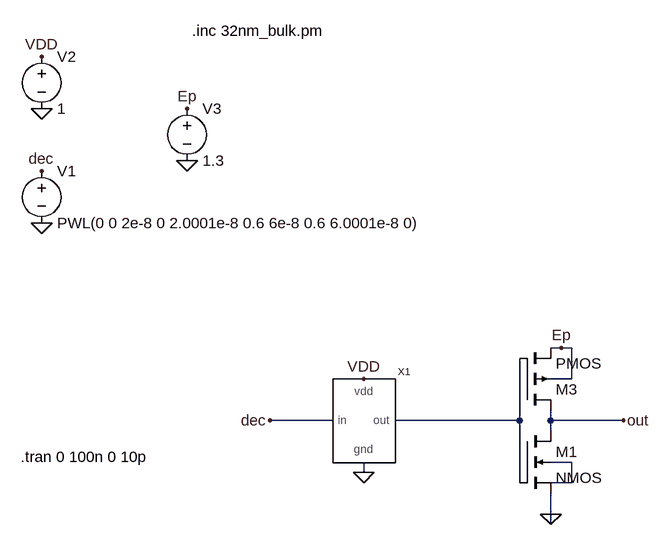
[diagram p0: schematic buffer_amplifaer.asc]
buffer_amplifaer.asc, the LTspice schematic file:
Version 4
SHEET 1 880 680
WIRE 464 384 448 384
WIRE 480 384 464 384
WIRE 480 432 480 384
WIRE 480 432 448 432
WIRE 112 496 16 496
WIRE 400 496 400 400
WIRE 400 496 208 496
WIRE 448 496 448 480
WIRE 560 496 448 496
WIRE 448 512 448 496
WIRE 480 560 448 560
WIRE 160 576 160 560
WIRE 400 592 400 496
WIRE 480 592 480 560
WIRE 480 592 448 592
WIRE 448 640 448 608
WIRE 448 656 448 640
FLAG 448 640 0
FLAG 160 576 0
FLAG 160 432 VDD
FLAG 560 496 out
FLAG -336 192 0
FLAG -336 16 0
FLAG -336 -64 VDD
FLAG -336 112 dec
FLAG 16 496 dec
FLAG -112 16 Ep
FLAG 464 384 Ep
FLAG -112 96 0
SYMBOL invert 160 496 R0
SYMATTR InstName X1
SYMBOL voltage -336 96 R0
WINDOW 123 0 0 Left 0
WINDOW 39 0 0 Left 0
SYMATTR InstName V1
SYMATTR Value PWL(0 0 2e-8 0 2.0001e-8 0.6 6e-8 0.6 6.0001e-8 0)
SYMBOL voltage -336 -80 R0
WINDOW 123 0 0 Left 0
WINDOW 39 0 0 Left 0
SYMATTR InstName V2
SYMATTR Value 1
SYMBOL voltage -112 0 R0
WINDOW 123 0 0 Left 0
WINDOW 39 0 0 Left 0
SYMATTR InstName V3
SYMATTR Value 1.3
SYMBOL pmos4 400 480 M180
SYMATTR InstName M3
SYMATTR Value2 l=32e-9 w=640e-9 ad=51200e-18 as=51200e-18 pd=960e-9 ps=960e-9
SYMBOL nmos4 400 512 R0
SYMATTR InstName M1
SYMATTR Value2 l=32e-9 w=320e-9 ad=51200e-18 as=51200e-18 pd=960e-9 ps=960e-9
TEXT -104 -104 Left 2 !.inc 32nm_bulk.pm
TEXT -368 552 Left 2 !.tran 0 100n 0 10p

The netlist it stands for:
* buffer_amplifaer.asc
XX1 dec VDD 0 N001 invert  ; pins in vdd gnd out
V1 dec 0 PWL(0 0 2e-8 0 2.0001e-8 0.6 6e-8 0.6 6.0001e-8 0)
V2 VDD 0 1
V3 Ep 0 1.3
M3 out N001 Ep Ep PMOS l=32e-9 w=640e-9 ad=51200e-18 as=51200e-18 pd=960e-9 ps=960e-9
M1 out N001 0 N002 NMOS l=32e-9 w=320e-9 ad=51200e-18 as=51200e-18 pd=960e-9 ps=960e-9
.model NMOS NMOS
.model PMOS PMOS
.lib standard.mos
.inc 32nm_bulk.pm
.tran 0 100n 0 10p
.backanno
.end

* Results of the author's LTspice run, read from the files saved beside the schematic
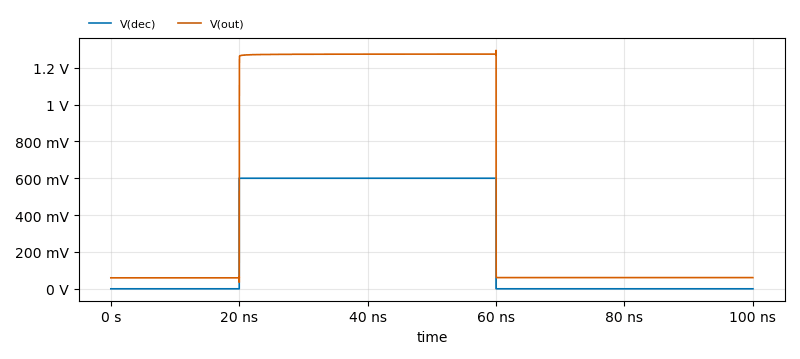
[diagram p1: Transient Analysis of buffer_amplifaer.asc, plotted from the saved traces]
* Transient Analysis, 1 run:
*   V(dec): min 0 V, max 600 mV, average 240 mV, rms 379.5 mV, last 0 V
*   V(out): min 35.5 mV, max 1.294 V, average 545.4 mV, rms 806.3 mV, last 60.81 mV